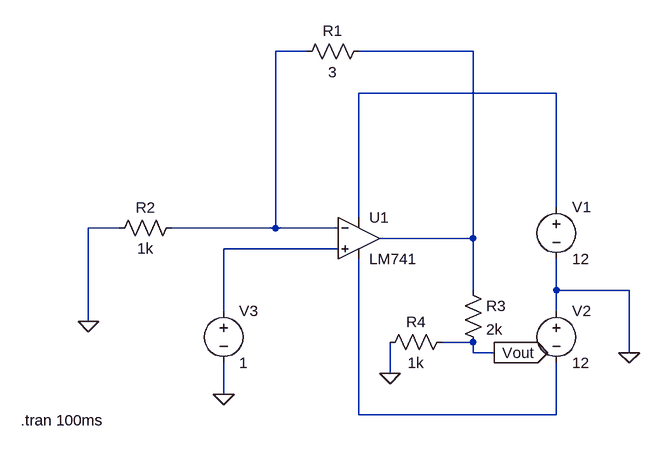
[diagram p0: schematic Complete.asc]
Complete.asc, the LTspice schematic file:
Version 4
SHEET 1 1664 680
WIRE 144 -304 96 -304
WIRE 400 -304 224 -304
WIRE 528 -240 224 -240
WIRE 528 -64 528 -240
WIRE 224 -48 224 -240
WIRE -144 -32 -192 -32
WIRE 96 -32 96 -304
WIRE 96 -32 -64 -32
WIRE 192 -32 96 -32
WIRE 400 -16 400 -304
WIRE 400 -16 256 -16
WIRE 192 0 16 0
WIRE 400 64 400 -16
WIRE 528 64 528 16
WIRE 640 64 528 64
WIRE 16 96 16 0
WIRE 528 96 528 64
WIRE -192 112 -192 -32
WIRE 400 144 352 144
WIRE 400 160 400 144
WIRE 432 160 400 160
WIRE 640 160 640 64
WIRE 272 192 272 144
WIRE 16 224 16 176
WIRE 224 256 224 16
WIRE 528 256 528 176
WIRE 528 256 224 256
FLAG 640 160 0
FLAG 16 224 0
FLAG -192 112 0
FLAG 432 160 Vout
IOPIN 432 160 Out
FLAG 272 192 0
SYMBOL LM741 224 -80 R0
SYMATTR InstName U1
SYMBOL voltage 528 -80 R0
WINDOW 123 0 0 Left 0
WINDOW 39 0 0 Left 0
SYMATTR InstName V1
SYMATTR Value 12
SYMBOL voltage 528 80 R0
WINDOW 123 0 0 Left 0
WINDOW 39 0 0 Left 0
SYMATTR InstName V2
SYMATTR Value 12
SYMBOL res 240 -320 R90
WINDOW 0 0 56 VBottom 2
WINDOW 3 32 56 VTop 2
SYMATTR InstName R1
SYMATTR Value 3
SYMBOL voltage 16 80 R0
WINDOW 123 0 0 Left 0
WINDOW 39 0 0 Left 0
SYMATTR InstName V3
SYMATTR Value 1
SYMBOL res -48 -48 R90
WINDOW 0 0 56 VBottom 2
WINDOW 3 32 56 VTop 2
SYMATTR InstName R2
SYMATTR Value 1k
SYMBOL res 384 48 R0
SYMATTR InstName R3
SYMATTR Value 2k
SYMBOL res 368 128 R90
WINDOW 0 0 56 VBottom 2
WINDOW 3 32 56 VTop 2
SYMATTR InstName R4
SYMATTR Value 1k
TEXT -296 264 Left 2 !.tran 100ms

The netlist it stands for:
* Complete.asc
XU1 N004 N001 N003 N005 N002 LM741  ; pins In+ In- V+ V- OUT
V1 N003 0 12
V2 0 N005 12
R1 N002 N001 3
V3 N004 0 1
R2 N001 0 1k
R3 N002 Vout 2k
R4 Vout 0 1k
.tran 100ms
.lib LM741.lib
.backanno
.end